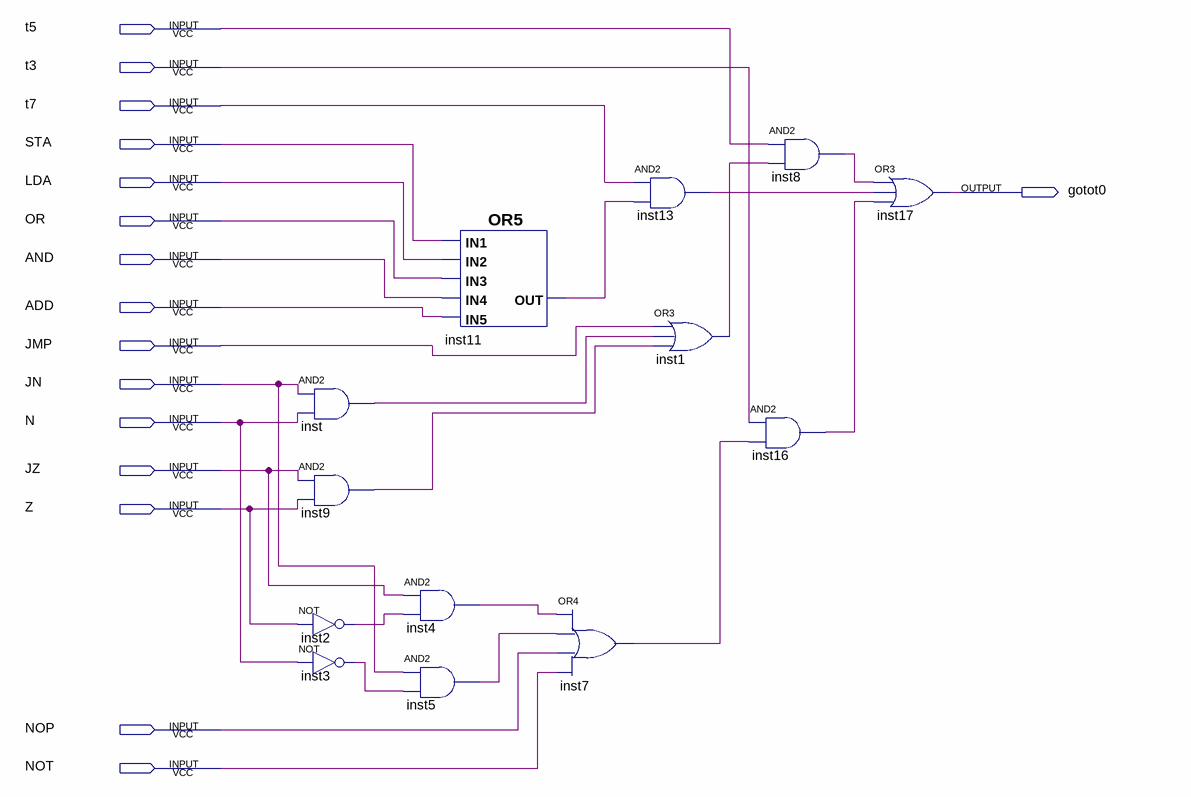
[diagram p0: schematic sheet]
// Quartus schematic gotot0.bdf as structural Verilog: 13 symbols, 16 pins
module gotot0 (
  input  t5,
  input  t3,
  input  t7,
  input  STA,
  input  LDA,
  input  OR,
  input  AND,
  input  ADD,
  input  JMP,
  input  JN,
  input  N,
  input  JZ,
  input  Z,
  input  NOP,
  input  NOT,
  output gotot0
);

  wire inst1_out, inst2_out, inst3_out, inst4_out, inst5_out, inst7_out, inst8_out, inst9_out, inst11_out,
       inst13_out, inst16_out, inst_out;

  and inst (inst_out, JN, N);
  and inst9 (inst9_out, JZ, Z);
  not inst2 (inst2_out, Z);
  not inst3 (inst3_out, N);
  or inst11 (inst11_out, STA, LDA, OR, AND, ADD);
  and inst4 (inst4_out, JZ, inst2_out);
  and inst5 (inst5_out, JN, inst3_out);
  or inst7 (inst7_out, inst4_out, inst5_out, NOP, NOT);
  and inst13 (inst13_out, t7, inst11_out);
  or inst1 (inst1_out, JMP, inst_out, inst9_out);
  and inst8 (inst8_out, t5, inst1_out);
  and inst16 (inst16_out, t3, inst7_out);
  or inst17 (gotot0, inst8_out, inst13_out, inst16_out);
endmodule
